# Altium schematic sheet Battery_Charging_and_Bypass_Power_Supply.SchDoc: Battery Charging & Bypass Power Supply
size 292 x 193 mm; SheetNumber: 9; SheetTotal: 11; SheetSize: A4
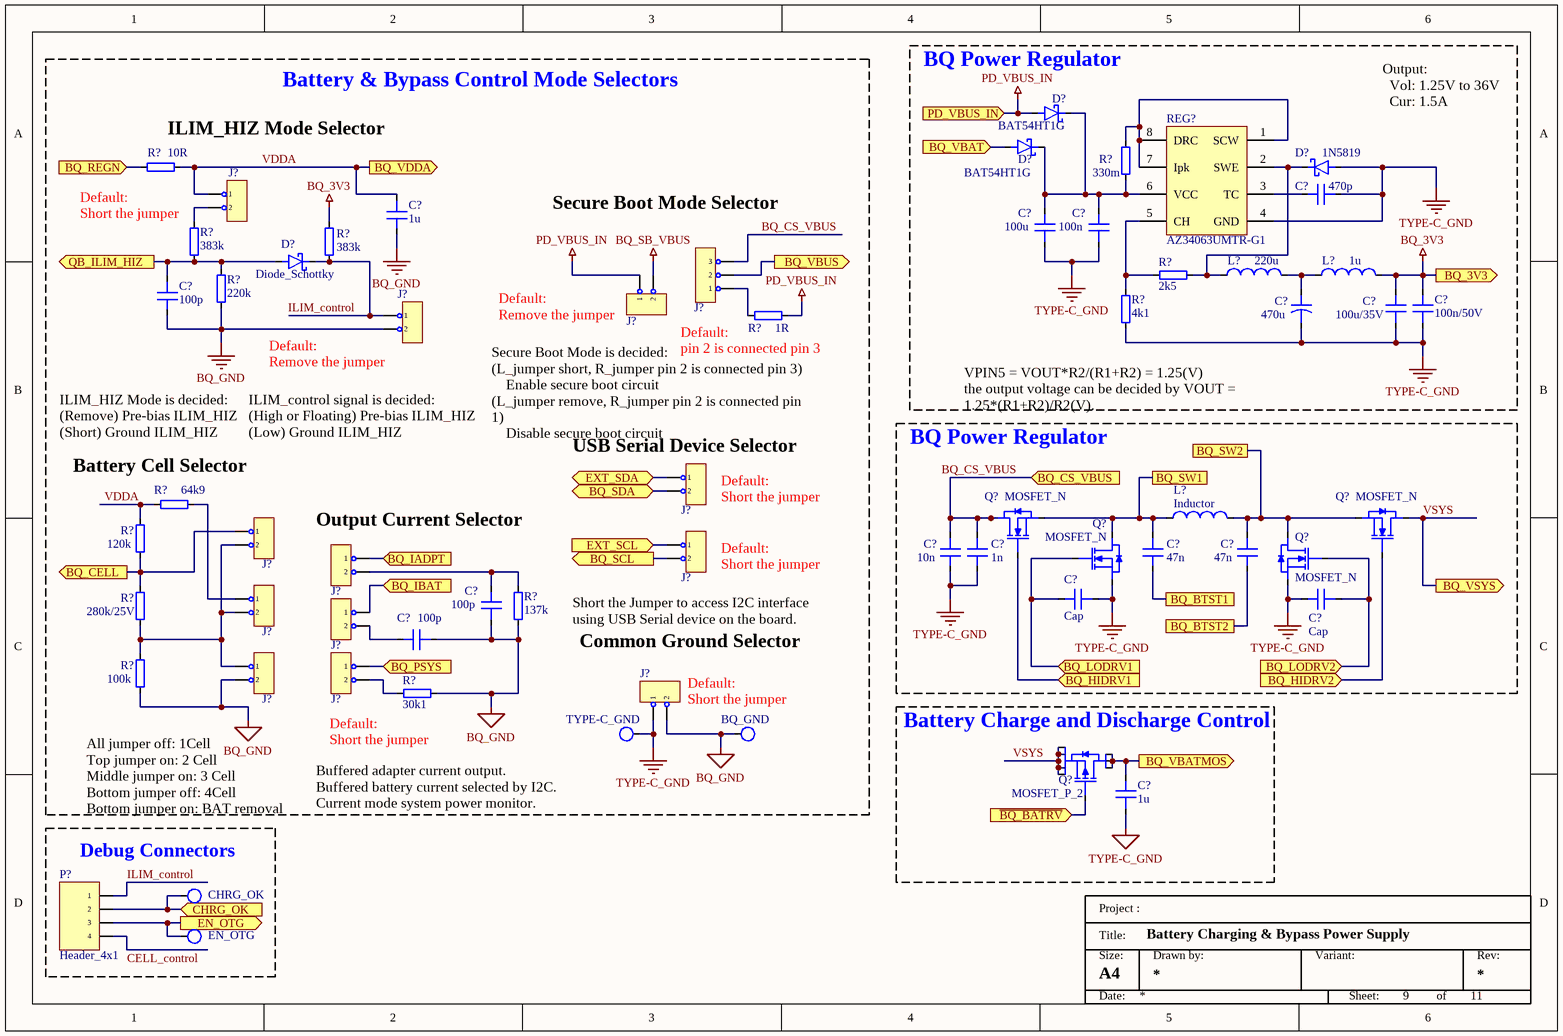
[diagram p0: Battery_Charging_and_Bypass_Power_Supply.SchDoc]

## Parts
(Parts that share a designator on the sheet are numbered #1, #2 ... from top to bottom, then left to right.)
BQ_GND  SMD_25mil  [TestPoint_smd_25mil]  (value not drawn)
C?#1  470p  [0805_Cap]
C?#2  100u  [0805_Cap]
C?#3  100n  [0805_Cap]
C?#4  1u  [0805_Cap]
C?#5  470u
C?#6  100u/35V  [0805_Cap]
C?#7  100n/50V  [0805_Cap]
C?#8  100p  [0805_Cap]
C?#9  10n  [0805_Cap]
C?#10  1n  [0805_Cap]
C?#11  47n  [0805_Cap]
C?#12  47n  [0805_Cap]
C?#13  100p  [0805_Cap]
C?#14  Cap  [0805_Cap]
C?#15  Cap  [0805_Cap]
C?#16  100p  [0805_Cap]
C?#17  1u  [0805_Cap]
CHRG_OK  SMD_25mil  [TestPoint_smd_25mil]  (value not drawn)
D?#1  BAT54HT1G
D?#2  BAT54HT1G
D?#3  1N5819
D?#4  Diode_Schottky
EN_OTG  SMD_25mil  [TestPoint_smd_25mil]  (value not drawn)
J?#1  Jumper_2x1  [Dupont_Header_(male)_2.54_2x1]  (value not drawn)
J?#2  Jumper_2x1  [Dupont_Header_(male)_2.54_2x1]  (value not drawn)
J?#3  Jumper_3x1  [Dupont_Header_(male)_2.54_3x1]  (value not drawn)
J?#4  Jumper_2x1  [Dupont_Header_(male)_2.54_2x1]  (value not drawn)
J?#5  Jumper_2x1  [Dupont_Header_(male)_2.54_2x1]  (value not drawn)
J?#6  Jumper_2x1  [Dupont_Header_(male)_2.54_2x1]  (value not drawn)
J?#7  Jumper_2x1  [Dupont_Header_(male)_2.54_2x1]  (value not drawn)
J?#8  Jumper_2x1  [Dupont_Header_(male)_2.54_2x1]  (value not drawn)
J?#9  Jumper_2x1  [Dupont_Header_(male)_2.54_2x1]  (value not drawn)
J?#10  Jumper_2x1  [Dupont_Header_(male)_2.54_2x1]  (value not drawn)
J?#11  Jumper_2x1  [Dupont_Header_(male)_2.54_2x1]  (value not drawn)
J?#12  Jumper_2x1  [Dupont_Header_(male)_2.54_2x1]  (value not drawn)
J?#13  Jumper_2x1  [Dupont_Header_(male)_2.54_2x1]  (value not drawn)
L?#1  220u  [1212_Ind]
L?#2  1u  [1212_Ind]
L?#3  Inductor  [1212_Ind]
P?  Header_4x1  [XT60PW-M]
Q?#1  MOSFET_N  [SOT-523-3]
Q?#2  MOSFET_N  [SOT-523-3]
Q?#3  MOSFET_N  [SOT-523-3]
Q?#4  MOSFET_N  [SOT-523-3]
Q?#5  MOSFET_P_2  [VSONP-8]
R?#1  330m  [0603_Res]
R?#2  10R  [0603_Res]
R?#3  383k  [0603_Res]
R?#4  383k  [0603_Res]
R?#5  220k  [0603_Res]
R?#6  2k5  [0603_Res]
R?#7  1R  [0603_Res]
R?#8  4k1  [0603_Res]
R?#9  64k9  [0603_Res]
R?#10  120k  [0603_Res]
R?#11  280k/25V  [0603_Res]
R?#12  137k  [0603_Res]
R?#13  100k  [0603_Res]
R?#14  30k1  [0603_Res]
REG?  AZ34063UMTR-G1  [SOIC-8]
TYPE-C_GND  SMD_25mil  [TestPoint_smd_25mil]  (value not drawn)

## Blocks framed on the sheet
Battery & Bypass Control Mode Selectors: BQ_GND C?#4 C?#8 C?#13 C?#16 D?#4 J?#1-J?#13 R?#2-R?#5 R?#7 R?#9-R?#14 TYPE-C_GND
BQ Power Regulator: C?#1-C?#3 C?#5-C?#7 D?#1-D?#3 L?#1 L?#2 R?#1 R?#6 R?#8 REG?
BQ Power Regulator: C?#9-C?#12 C?#14 C?#15 L?#3 Q?#1-Q?#4
Battery Charge and Discharge Control: C?#17 Q?#5
Debug Connectors: CHRG_OK EN_OTG P?

## Ports
BQ_3V3 (out), BQ_BTST1, BQ_BTST2, BQ_CELL (out), BQ_CS_VBUS (in), BQ_HIDRV1 (in), BQ_HIDRV2 (in), BQ_IADPT (in), BQ_IBAT (in), BQ_LODRV1 (in), BQ_LODRV2 (in), BQ_PSYS (in), BQ_REGN (in), BQ_SCL (out), BQ_SDA (bidir), BQ_SW1, BQ_SW2, BQ_VBAT (in), BQ_VBATMOS (out), BQ_VBUS (out), BQ_VDDA (out), BQ_VSYS (out), CHRG_OK (in), EN_OTG (out), EXT_SCL (in), EXT_SDA (bidir), PD_VBUS_IN (in), QB_ILIM_HIZ (out), ~{BQ_BATRV} (in)

## Nets
BQ_3V3: C?#6.1 C?#7.1 L?#2.2 R?#4.2 ; port BQ_3V3
BQ_GND: BQ_GND.1 C?#4.1 C?#8.1 C?#13.2 C?#16.2 J?#2.2 J?#11.2 J?#13.2 R?#5.2 R?#12.1 R?#13.1 R?#14.1
BQ_SB_VBUS: J?#4.2
PD_VBUS_IN: D?#1.1(A) J?#4.1 R?#7.2 ; port PD_VBUS_IN
TYPE-C_GND: C?#1.2 C?#2.2 C?#3.2 C?#5.2 C?#6.2 C?#7.2 C?#9.1 C?#10.1 C?#14.2 C?#15.1 C?#17.2 D?#3.1(A) J?#13.1 Q?#2.3(S) Q?#3.3(S) R?#8.1 REG?.4(GND) TYPE-C_GND.1
~{BQ_BATRV}: Q?#5.4(G) ; port ~{BQ_BATRV}
BQ_BTST1: C?#11.1 ; port BQ_BTST1
BQ_BTST2: C?#12.1 ; port BQ_BTST2
BQ_CELL: J?#6.1 R?#10.1 R?#11.2 ; port BQ_CELL
BQ_CS_VBUS: C?#9.2 C?#10.2 J?#3.3 Q?#1.1(D) ; port BQ_CS_VBUS
BQ_HIDRV1: Q?#1.2(G) ; port BQ_HIDRV1
BQ_HIDRV2: Q?#4.2(G) ; port BQ_HIDRV2
BQ_IADPT: J?#8.1 ; port BQ_IADPT
BQ_IBAT: J?#10.1 ; port BQ_IBAT
BQ_LODRV1: C?#14.1 Q?#2.2(G) ; port BQ_LODRV1
BQ_LODRV2: C?#15.2 Q?#3.2(G) ; port BQ_LODRV2
BQ_PSYS: J?#12.1 ; port BQ_PSYS
BQ_REGN: R?#2.1 ; port BQ_REGN
BQ_SCL: J?#7.2 ; port BQ_SCL
BQ_SDA: J?#5.2 ; port BQ_SDA
BQ_SW1: C?#11.2 L?#3.1 Q?#1.3(S) Q?#2.1(D) ; port BQ_SW1
BQ_SW2: C?#12.2 L?#3.2 Q?#3.1(D) Q?#4.3(S) ; port BQ_SW2
BQ_VBAT: D?#2.1(A) ; port BQ_VBAT
BQ_VBATMOS: C?#17.1 Q?#5.1(D1_1) Q?#5.2(D1_2) Q?#5.3(D1_3) ; port BQ_VBATMOS
BQ_VBUS: J?#3.2 ; port BQ_VBUS
CELL_control: P?.4
CHRG_OK: CHRG_OK.1 P?.2 ; port CHRG_OK
EN_OTG: EN_OTG.1 P?.3 ; port EN_OTG
EXT_SCL: J?#7.1 ; port EXT_SCL
EXT_SDA: J?#5.1 ; port EXT_SDA
ILIM_control: D?#4.2(K) J?#2.1 P?.1 R?#4.1
QB_ILIM_HIZ: C?#8.2 D?#4.1(A) R?#3.1 R?#5.1 ; port QB_ILIM_HIZ
VDDA: C?#4.2 J?#1.1 R?#2.2 R?#9.2 R?#10.2 ; port BQ_VDDA
VSYS: Q?#4.1(D) Q?#5.5(S1_1) Q?#5.6(S1_2) Q?#5.7(S1_3) Q?#5.8(S1_4) ; port BQ_VSYS
NetC?#1_1: C?#1.1 REG?.3(TC)
NetC?#2_1: C?#2.1 C?#3.1 D?#1.2(K) D?#2.2(K) R?#1.2 REG?.6(VCC)
NetC?#5_1: C?#5.1 L?#1.2 L?#2.1
NetC?#13_1: C?#13.1 J?#8.2 R?#12.2
NetC?#16_1: C?#16.1 J?#10.2
NetD?#3_2: D?#3.2(K) L?#1.1 R?#6.1 REG?.2(SWE)
NetJ?#1_2: J?#1.2 R?#3.2
NetJ?#3_1: J?#3.1 R?#7.1
NetJ?#6_2: J?#6.2 J?#9.2 J?#11.1 R?#11.1 R?#13.2
NetJ?#9_1: J?#9.1 R?#9.1
NetJ?#12_2: J?#12.2 R?#14.2
NetR?#1_1: R?#1.1 REG?.1(SCW) REG?.7(Ipk) REG?.8(DRC)
NetR?#6_2: R?#6.2 R?#8.2 REG?.5(CH)

## Notes on the sheet
- Output:
  Vol: 1.25V to 36V
  Cur: 1.5A
- (near R?#2) ILIM_HIZ Mode Selector
- (near R?#3) Default:
  Short the jumper
- (near J?#3) Secure Boot Mode Selector
- (near J?#2) Default:
  Remove the jumper
- (near J?#4) Default:
  Remove the jumper
- (near R?#7) Default:
  pin 2 is connected pin 3
- ILIM_HIZ Mode is decided:
  (Remove) Pre-bias ILIM_HIZ
  (Short) Ground ILIM_HIZ
- ILIM_control signal is decided:
  (High or Floating) Pre-bias ILIM_HIZ
  (Low) Ground ILIM_HIZ
- (near R?#7) Secure Boot Mode is decided:
  (L_jumper short, R_jumper pin 2 is connected pin 3)
  Enable secure boot circuit
  (L_jumper remove, R_jumper pin 2 is connected pin 1)
  Disable secure boot circuit
- VPIN5 = VOUT*R2/(R1+R2) = 1.25(V)
  the output voltage can be decided by VOUT = 1.25*(R1+R2)/R2(V).
- (near R?#9) Battery Cell Selector
- (near J?#5) USB Serial Device Selector
- (near J?#5) Default:
  Short the jumper
- (near J?#8) Output Current Selector
- (near J?#7) Default:
  Short the jumper
- Short the Jumper to access I2C interface using USB Serial device on the board.
- Common Ground Selector
- Default:
  Short the jumper
- All jumper off: 1Cell
  Top jumper on: 2 Cell
  Middle jumper on: 3 Cell
  Bottom jumper off: 4Cell
  Bottom jumper on: BAT removal
- Buffered adapter current output.
  Buffered battery current selected by I2C.
  Current mode system power monitor.
- Project :
- Size:
- Title:
- Drawn by:
- Variant:
- Rev:
- Date:
- Sheet:
- of

## Library data of the parts
BQ_GND CHRG_OK EN_OTG TYPE-C_GND = Test_Point: General test point; Mfr. #: N/A; Mfr.: N/A; Distributor_Link: N/A; Datasheet: N/A; Distributor #: N/A
C?#1-C?#4 C?#6-C?#17 = Cap: General capacitor (non-polarized); Mfr. #: *; Mfr.: *; Distributor_Link: *; Datasheet: *; Distributor #: *
C?#5 = Cap_2: General capacitor (with polarity); Mfr. #: *; Mfr.: *; Distributor_Link: *; Datasheet: *; Distributor #: *
D?#1-D?#4 = Diode_Schottky: General schottky diode; Mfr. #: *; Mfr.: *; Distributor_Link: *; Datasheet: *; Distributor #: *
J?#1 J?#2 J?#4-J?#13 = Jumper_2x1: General Jumper 2x1; Mfr. #: *; Mfr.: *; Distributor_Link: *; Datasheet: *; Distributor #: *
J?#3 = Jumper_3x1: General Jumper 3x1; Mfr. #: *; Mfr.: *; Distributor_Link: *; Datasheet: *; Distributor #: *
L?#1-L?#3 = Inductor: General Inductor; Mfr. #: *; Mfr.: *; Distributor_Link: *; Datasheet: *; Distributor #: *
P? = Header_4x1: General header 4x1; Mfr. #: *; Mfr.: *; Distributor_Link: *; Datasheet: *; Distributor #: *
Q?#1-Q?#4 = MOSFET_N: General n channel mosfet; Mfr. #: *; Mfr.: *; Distributor_Link: *; Datasheet: *; Distributor #: *
Q?#5 = MOSFET_P_2: General p channel mosfet; Mfr. #: *; Mfr.: *; Distributor_Link: *; Datasheet: *; Distributor #: *
R?#1-R?#14 = Res: General Resistor; Mfr. #: *; Mfr.: *; Distributor_Link: *; Datasheet: *; Distributor #: *
REG? = AZ34063UMTR-G1: USB Interface IC USB Type-C port controller (BCR) CYPD3177; Mfr.: Diodes Incorporated; Distributor_Link: https://www.mouser.tw/ProductDetail/Diodes-Incorporated/AZ34063UMTR-G1?qs=FKu9oBikfSmOGMlC%2Fa3O3g%3D%3D; Mfr. #: AZ34063UMTR-G1; Datasheet: https://www.diodes.com/assets/Datasheets/AZ34063U.pdf; Distributor #: 621-AZ34063UMTR-G1